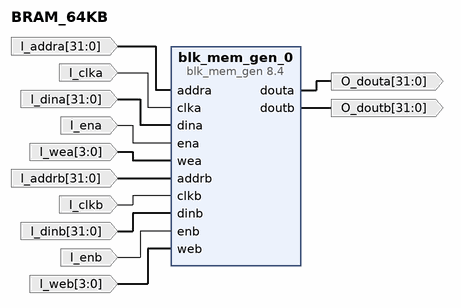
[diagram p0: block diagram of the top level]
# Vivado block design BRAM_64KB, xc7s50csga324-2, Vivado 2018.1
create_bd_design BRAM_64KB

create_bd_port -dir I -from 31 -to 0 I_addra
create_bd_port -dir I -type clk I_clka
create_bd_port -dir I -from 31 -to 0 I_dina
create_bd_port -dir O -from 31 -to 0 O_douta
create_bd_port -dir I I_ena
create_bd_port -dir I -from 3 -to 0 I_wea
create_bd_port -dir I -from 31 -to 0 I_addrb
create_bd_port -dir I -type clk I_clkb
create_bd_port -dir I -from 31 -to 0 I_dinb
create_bd_port -dir O -from 31 -to 0 O_doutb
create_bd_port -dir I I_enb
create_bd_port -dir I -from 3 -to 0 I_web

create_bd_cell -type ip -vlnv xilinx.com:ip:blk_mem_gen:8.4 blk_mem_gen_0
set_property -dict [list \
  CONFIG.Memory_Type True_Dual_Port_RAM \
  CONFIG.Enable_32bit_Address true \
  CONFIG.Write_Depth_A 16384 \
  CONFIG.Enable_B Use_ENB_Pin \
  CONFIG.Register_PortA_Output_of_Memory_Primitives false \
  CONFIG.Register_PortB_Output_of_Memory_Primitives false \
  CONFIG.Load_Init_File true \
  CONFIG.Coe_File ../../../../../../../rom/coe/bootloader.coe \
  CONFIG.Fill_Remaining_Memory_Locations true \
  CONFIG.Use_RSTA_Pin false \
  CONFIG.Use_RSTB_Pin false \
  CONFIG.Port_B_Clock 100 \
  CONFIG.Port_B_Write_Rate 50 \
  CONFIG.Port_B_Enable_Rate 100 \
  CONFIG.use_bram_block Stand_Alone \
] [get_bd_cells blk_mem_gen_0]

# ---- connections ----

connect_bd_net [get_bd_ports I_addra] [get_bd_pins blk_mem_gen_0/addra]
connect_bd_net [get_bd_ports I_clka] [get_bd_pins blk_mem_gen_0/clka]
connect_bd_net [get_bd_ports I_dina] [get_bd_pins blk_mem_gen_0/dina]
connect_bd_net [get_bd_pins blk_mem_gen_0/douta] [get_bd_ports O_douta]
connect_bd_net [get_bd_ports I_ena] [get_bd_pins blk_mem_gen_0/ena]
connect_bd_net [get_bd_ports I_wea] [get_bd_pins blk_mem_gen_0/wea]
connect_bd_net [get_bd_ports I_addrb] [get_bd_pins blk_mem_gen_0/addrb]
connect_bd_net [get_bd_ports I_clkb] [get_bd_pins blk_mem_gen_0/clkb]
connect_bd_net [get_bd_ports I_dinb] [get_bd_pins blk_mem_gen_0/dinb]
connect_bd_net [get_bd_pins blk_mem_gen_0/doutb] [get_bd_ports O_doutb]
connect_bd_net [get_bd_ports I_enb] [get_bd_pins blk_mem_gen_0/enb]
connect_bd_net [get_bd_ports I_web] [get_bd_pins blk_mem_gen_0/web]

validate_bd_design
save_bd_design
